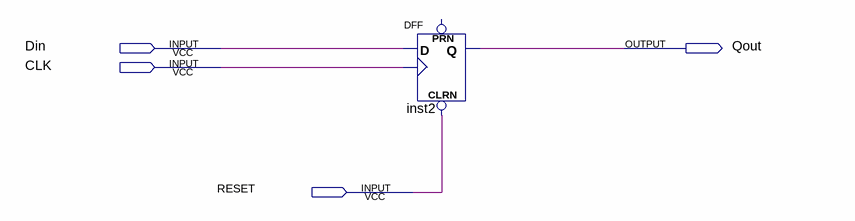
[diagram p0: schematic sheet]
// Quartus schematic hw3_1.bdf as structural Verilog: 1 symbols, 4 pins
module hw3_1 (
  input  Din,
  input  CLK,
  input  RESET,
  output Qout
);

  DFF inst2 (.CLRN(RESET), .CLK(CLK), .D(Din), .Q(Qout));  // open: PRN
endmodule
